# Altium schematic sheet io.SchDoc
size A2; SheetNumber: 2; SheetTotal: 4
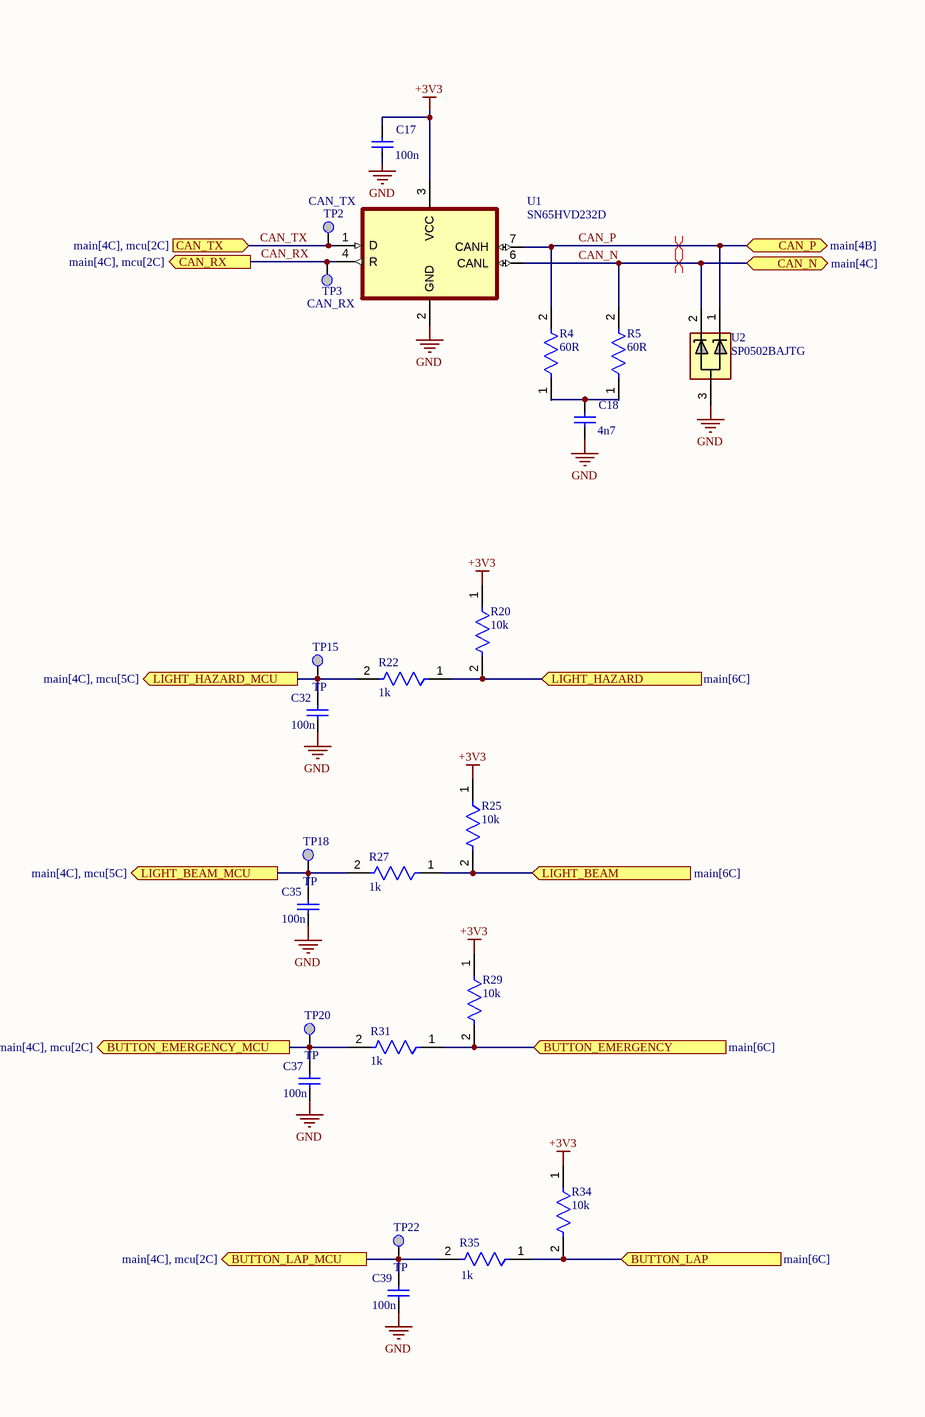
[diagram p0: io.SchDoc, left]
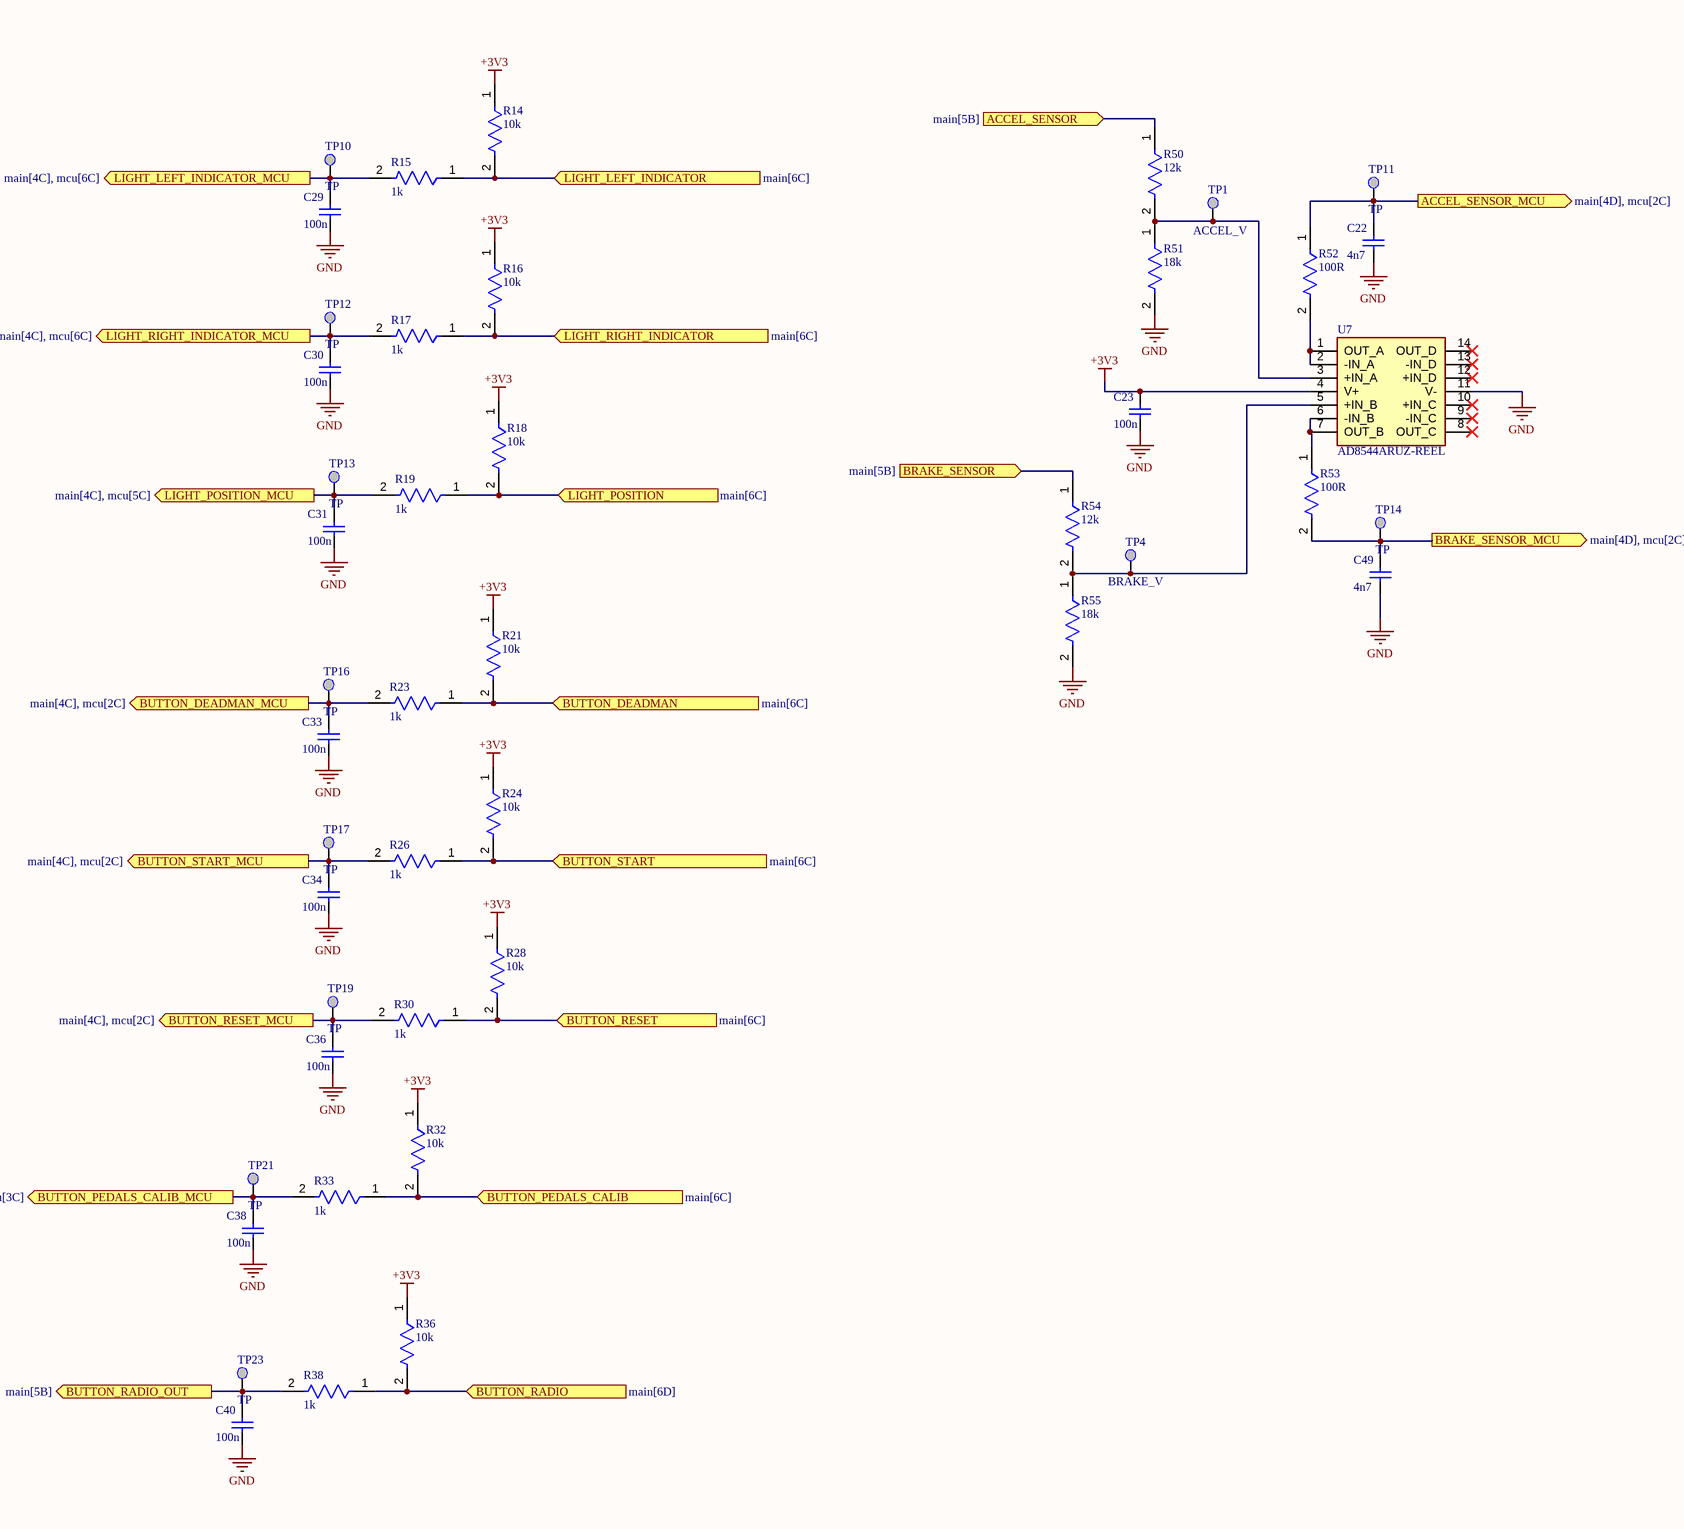
[diagram p1: io.SchDoc, right]

## Parts
C17  100n  [CAPC1206(3216)150_L]
C18  4n7  [CAPC1206(3216)150_L]
C22  4n7  [CAPC1206(3216)150_L]
C23  100n  [CAPC1206(3216)150_L]
C29  100n  [CAPC1206(3216)150_L]
C30  100n  [CAPC1206(3216)150_L]
C31  100n  [CAPC1206(3216)150_L]
C32  100n  [CAPC1206(3216)150_L]
C33  100n  [CAPC1206(3216)150_L]
C34  100n  [CAPC1206(3216)150_L]
C35  100n  [CAPC1206(3216)150_L]
C36  100n  [CAPC1206(3216)150_L]
C37  100n  [CAPC1206(3216)150_L]
C38  100n  [CAPC1206(3216)150_L]
C39  100n  [CAPC1206(3216)150_L]
C40  100n  [CAPC1206(3216)150_L]
C49  4n7  [CAPC1206(3216)150_L]
R4  60R  [FP-RK73H2B-MFG]
R5  60R  [FP-RK73H2B-MFG]
R14  10k  [FP-RK73H2B-MFG]
R15  1k  [FP-RK73H2B-MFG]
R16  10k  [FP-RK73H2B-MFG]
R17  1k  [FP-RK73H2B-MFG]
R18  10k  [FP-RK73H2B-MFG]
R19  1k  [FP-RK73H2B-MFG]
R20  10k  [FP-RK73H2B-MFG]
R21  10k  [FP-RK73H2B-MFG]
R22  1k  [FP-RK73H2B-MFG]
R23  1k  [FP-RK73H2B-MFG]
R24  10k  [FP-RK73H2B-MFG]
R25  10k  [FP-RK73H2B-MFG]
R26  1k  [FP-RK73H2B-MFG]
R27  1k  [FP-RK73H2B-MFG]
R28  10k  [FP-RK73H2B-MFG]
R29  10k  [FP-RK73H2B-MFG]
R30  1k  [FP-RK73H2B-MFG]
R31  1k  [FP-RK73H2B-MFG]
R32  10k  [FP-RK73H2B-MFG]
R33  1k  [FP-RK73H2B-MFG]
R34  10k  [FP-RK73H2B-MFG]
R35  1k  [FP-RK73H2B-MFG]
R36  10k  [FP-RK73H2B-MFG]
R38  1k  [FP-RK73H2B-MFG]
R50  12k  [FP-RK73H2B-MFG]
R51  18k  [FP-RK73H2B-MFG]
R52  100R  [FP-RK73H2B-MFG]
R53  100R  [FP-RK73H2B-MFG]
R54  12k  [FP-RK73H2B-MFG]
R55  18k  [FP-RK73H2B-MFG]
TP1  ACCEL_V  [Test_Point]
TP2  CAN_TX  [Test_Point]
TP3  CAN_RX  [Test_Point]
TP4  BRAKE_V  [Test_Point]
TP10  TP  [Test_Point]
TP11  TP  [Test_Point]
TP12  TP  [Test_Point]
TP13  TP  [Test_Point]
TP14  TP  [Test_Point]
TP15  TP  [Test_Point]
TP16  TP  [Test_Point]
TP17  TP  [Test_Point]
TP18  TP  [Test_Point]
TP19  TP  [Test_Point]
TP20  TP  [Test_Point]
TP21  TP  [Test_Point]
TP22  TP  [Test_Point]
TP23  TP  [Test_Point]
U1  SN65HVD232D  [SN65HVD232D]
U2  SP0502BAJTG  [SOT132P220X110-3N]
U7  AD8544ARUZ-REEL  [AD8544ARUZ-REEL]

## Ports
ACCEL_SENSOR (in, see main[5B]), ACCEL_SENSOR_MCU (out, see main[4D], mcu[2C]), BRAKE_SENSOR (in, see main[5B]), BRAKE_SENSOR_MCU (out, see main[4D], mcu[2C]), BUTTON_DEADMAN (in, see main[6C]), BUTTON_DEADMAN_MCU (out, see main[4C], mcu[2C]), BUTTON_EMERGENCY (in, see main[6C]), BUTTON_EMERGENCY_MCU (out, see main[4C], mcu[2C]), BUTTON_LAP (in, see main[6C]), BUTTON_LAP_MCU (out, see main[4C], mcu[2C]), BUTTON_PEDALS_CALIB (in, see main[6C]), BUTTON_PEDALS_CALIB_MCU (out, see main[4C], mcu[3C]), BUTTON_RADIO (in, see main[6D]), BUTTON_RADIO_OUT (out, see main[5B]), BUTTON_RESET (in, see main[6C]), BUTTON_RESET_MCU (out, see main[4C], mcu[2C]), BUTTON_START (in, see main[6C]), BUTTON_START_MCU (out, see main[4C], mcu[2C]), CAN_N (bidir, see main[4C]), CAN_P (bidir, see main[4B]), CAN_RX (out, see main[4C], mcu[2C]), CAN_TX (in, see main[4C], mcu[2C]), LIGHT_BEAM (in, see main[6C]), LIGHT_BEAM_MCU (out, see main[4C], mcu[5C]), LIGHT_HAZARD (in, see main[6C]), LIGHT_HAZARD_MCU (out, see main[4C], mcu[5C]), LIGHT_LEFT_INDICATOR (in, see main[6C]), LIGHT_LEFT_INDICATOR_MCU (out, see main[4C], mcu[6C]), LIGHT_POSITION (in, see main[6C]), LIGHT_POSITION_MCU (out, see main[4C], mcu[5C]), LIGHT_RIGHT_INDICATOR (in, see main[6C]), LIGHT_RIGHT_INDICATOR_MCU (out, see main[4C], mcu[6C])

## Nets
+3V3: C17.1 C23.1 R14.1 R16.1 R18.1 R20.1 R21.1 R24.1 R25.1 R28.1 R29.1 R32.1 R34.1 R36.1 U1.3(VCC) U7.4(V+)
GND: C17.2 C18.2 C22.2 C23.2 C29.2 C30.2 C31.2 C32.2 C33.2 C34.2 C35.2 C36.2 C37.2 C38.2 C39.2 C40.2 C49.2 R51.2 R55.2 U1.2(GND) U2.3 U7.11(V-)
ACCEL_SENSOR: R50.1 ; port ACCEL_SENSOR
ACCEL_SENSOR_MCU: C22.1 R52.1 TP11.1 ; port ACCEL_SENSOR_MCU
BRAKE_SENSOR: R54.1 ; port BRAKE_SENSOR
BRAKE_SENSOR_MCU: C49.1 R53.2 TP14.1 ; port BRAKE_SENSOR_MCU
BUTTON_DEADMAN: R21.2 R23.1 ; port BUTTON_DEADMAN
BUTTON_DEADMAN_MCU: C33.1 R23.2 TP16.1 ; port BUTTON_DEADMAN_MCU
BUTTON_EMERGENCY: R29.2 R31.1 ; port BUTTON_EMERGENCY
BUTTON_EMERGENCY_MCU: C37.1 R31.2 TP20.1 ; port BUTTON_EMERGENCY_MCU
BUTTON_LAP: R34.2 R35.1 ; port BUTTON_LAP
BUTTON_LAP_MCU: C39.1 R35.2 TP22.1 ; port BUTTON_LAP_MCU
BUTTON_PEDALS_CALIB: R32.2 R33.1 ; port BUTTON_PEDALS_CALIB
BUTTON_PEDALS_CALIB_MCU: C38.1 R33.2 TP21.1 ; port BUTTON_PEDALS_CALIB_MCU
BUTTON_RADIO: R36.2 R38.1 ; port BUTTON_RADIO
BUTTON_RADIO_OUT: C40.1 R38.2 TP23.1 ; port BUTTON_RADIO_OUT
BUTTON_RESET: R28.2 R30.1 ; port BUTTON_RESET
BUTTON_RESET_MCU: C36.1 R30.2 TP19.1 ; port BUTTON_RESET_MCU
BUTTON_START: R24.2 R26.1 ; port BUTTON_START
BUTTON_START_MCU: C34.1 R26.2 TP17.1 ; port BUTTON_START_MCU
CAN_N: R5.2 U1.6(CANL) U2.2 ; port CAN_N
CAN_P: R4.2 U1.7(CANH) U2.1 ; port CAN_P
CAN_RX: TP3.1 U1.4(R) ; port CAN_RX
CAN_TX: TP2.1 U1.1(D) ; port CAN_TX
LIGHT_BEAM: R25.2 R27.1 ; port LIGHT_BEAM
LIGHT_BEAM_MCU: C35.1 R27.2 TP18.1 ; port LIGHT_BEAM_MCU
LIGHT_HAZARD: R20.2 R22.1 ; port LIGHT_HAZARD
LIGHT_HAZARD_MCU: C32.1 R22.2 TP15.1 ; port LIGHT_HAZARD_MCU
LIGHT_LEFT_INDICATOR: R14.2 R15.1 ; port LIGHT_LEFT_INDICATOR
LIGHT_LEFT_INDICATOR_MCU: C29.1 R15.2 TP10.1 ; port LIGHT_LEFT_INDICATOR_MCU
LIGHT_POSITION: R18.2 R19.1 ; port LIGHT_POSITION
LIGHT_POSITION_MCU: C31.1 R19.2 TP13.1 ; port LIGHT_POSITION_MCU
LIGHT_RIGHT_INDICATOR: R16.2 R17.1 ; port LIGHT_RIGHT_INDICATOR
LIGHT_RIGHT_INDICATOR_MCU: C30.1 R17.2 TP12.1 ; port LIGHT_RIGHT_INDICATOR_MCU
NetC18_1: C18.1 R4.1 R5.1
NetR50_2: R50.2 R51.1 TP1.1 U7.3(+IN_A)
NetR52_2: R52.2 U7.1(OUT_A) U7.2(-IN_A)
NetR53_1: R53.1 U7.6(-IN_B) U7.7(OUT_B)
NetR54_2: R54.2 R55.1 TP4.1 U7.5(+IN_B)

Not connected (* = marked no-connect by the designer): U7 8(OUT_C)* 9(-IN_C)* 10(+IN_C)* 12(+IN_D)* 13(-IN_D)* 14(OUT_D)*

## Layout directives
differential pair: CAN_N, CAN_P

## Notes on the sheet
- DWG. NO.
- REV.
- SHT.
- REVISION
- DESCRIPTION
- DATE
- APPROVED
- THIS DOCUMENT AND THE DATA DISCLOSED HEREIN OR HEREWITH IS THE PROPERTY OF ALTIUM LIMITED AND MAY BE FREELY DISTRIBUTED IN WHOLE. NO RIGHTS ARE RESERVED OR EXPRESS OR IMPLIED WARANTEE GIVEN.
- ENG:
- DSN:
- APPROVALS
- PROJECT
- DOCUMENT REVISION:
- DESIGN ITEM:
- CHK:
- BOM:
- REFERENCE DOCUMENTS
- PROJECT REVISION:
- TITLE
- FAB DWG:
- PCB DWG:
- ASSY DWG:
- SCALE:
- SIZE
- C
- CAGE CODE
- FILE NAME
- DWG NO.
- SHEET
- OF
- REV

## Library data of the parts
C17 C18 C22 C23 C29-C40 C49 = CMP-1037-04778-1: CAP 1.8uF 10V ±5% 1206 (3216 Metric) Thickness 1.45mm SMD; Case-EIA: 1206; Tolerance: Â±5%; Case-Metric: 3216; Technology: SMT; Value: 1.8uF; Rated Voltage: 10 V; Max Thickness: 1.45 mm
R4 R5 R14-R36 R38 R50-R55 = CMP-04015-098385-1: 40.2kΩ ±1% 0.25W Chip Resistor 1206 Thick Film AEC-Q200 Qualified; Resistance: 40.2kR; Voltage Rating (DC): 200V; Temperature Coefficient: 100ppm/°C; Power Rating: 250mW; Tolerance: 1%; Package Quantity: 5000; Length: 3.2mm; Termination: SMD/SMT; Lead Free: Contains Lead; Case Code (Imperial): 1206; Case/Package: 1206; Voltage Rating: 200V; Case Code (Metric): 3216; Max Operating Temperature: 155°C; Packaging: Tape and Reel; Width: 1.6mm; Series: RK73H; Min Operating Temperature: -55°C; RoHS Compliant: No; Height: 0.6mm
TP1-TP4 TP10-TP23 = TestPoint
U1 = SN65HVD232D: Texas Instruments - SN65HVD232DR - Can Transceiver, 1MBPS, 1/1, 3.3V, SOIC-8, Full Reel; Manufacturer Lifecycle Status: ACTIVE; Max Supply Voltage: 3.6V; Min Supply Voltage: 3V; Nominal Supply Current: 17mA; Number of Drivers: 1; SnapEDA_Link: https://www.snapeda.com/parts/SN65HVD232D/Texas+Instruments/view-part/?ref=snap; Package: SOIC-8 Texas Instruments; Value: *; MF: Texas Instruments; MP: SN65HVD232D; Check_prices: https://www.snapeda.com/parts/SN65HVD232D/Texas+Instruments/view-part/?ref=eda; Supplier: Arrow Electronics; Supplier Part Number: SN65HVD232DR; Manufacturer: Texas Instruments; Manufacturer Part Number: SN65HVD232DR; RoHS: Compliant; Category: CAN Transceivers; Stock: 10000; Pricing: 2500=1,1159, 5000=1,076, 7500=1,062 (USD); Case/Package: SOIC; Data Rate: 1Mbps; Height: 1.75mm; Lead Free: Lead Free; Length: 4.9mm; Lifecycle Status: Production; Max Operating Temperature: 85°C; Min Operating Temperature: -40°C; Pins: 8; Number of Receive Buffers: 1; Number of Receivers: 1; Number of Transceivers: 1; Number of Transmit Buffers: 1; Packaging: Cut Tape; Radiation Hardening: No; REACH SVHC: No; Schedule B: 8542390000, 8542390000|8542390000|8542390000|8542390000|8542390000; Thickness: 1.58mm; Weight: 72.603129mg; Width: 3.91mm; ComponentLink1URL: https://octopart.com:443/opatz8j6/c1?t=KNMFt9M64p-_id6rZ0-P1CX6CGmvk_NFg0bt7DHXbi_P10EFF0MZE_9gM8ERckOxIywTBgDrXd4Bw1XwEAcVVdK92p9CEfdSNaVajf6_bxnez3EeN1RE1wZBaojbXTwQ_101S7Bb856c3hUAWErS0_zGIM1B6Z6dFQwv_Ps2SUdVVUCjmJkLnMLZKTBWfnIVcgJIheW78JYanUyW_1u-I93chBuiSPXQYIk2xXb9JgOyrE9lHEnesRSQq9luJOd1yknyGQP0N3Is0_dGM9QrGV5UOgjoada9tMnQwKJP8gahr3iTK59XJFH6OfbHTOm3R9BdESCrBMbrE2MVOGPPkVOTrqf0YMovDpmf-konbncFnSES8CNOhHqMwHv2HEwKcPoK44nl&src-supplier=Texas+Instruments; ComponentLink1Description: https://octopart.com:443/opatz8j6/c1?t=KNMFt9M64p-_id6rZ0-P1CX6CGmvk_NFg0bt7DHXbi_P10EFF0MZE_9gM8ERckOxIywTBgDrXd4Bw1XwEAcVVdK92p9CEfdSNaVajf6_bxnez3EeN1RE1wZBaojbXTwQ_101S7Bb856c3hUAWErS0_zGIM1B6Z6dFQwv_Ps2SUdVVUCjmJkLnMLZKTBWfnIVcgJIheW78JYanUyW_1u-I93chBuiSPXQYIk2xXb9JgOyrE9lHEnesRSQq9luJOd1yknyGQP0N3Is0_dGM9QrGV5UOgjoada9tMnQwKJP8gahr3iTK59XJFH6OfbHTOm3R9BdESCrBMbrE2MVOGPPkVOTrqf0YMovDpmf-konbncFnSES8CNOhHqMwHv2HEwKcPoK44nl&src-supplier=Texas+Instruments; ComponentLink2URL: https://sigma.octopart.com:443/49249642/technical_drawing/Texas-Instruments-SN65HVD232DR.pdf?src-supplier=Texas+Instruments; ComponentLink2Description: https://sigma.octopart.com:443/49249642/technical_drawing/Texas-Instruments-SN65HVD232DR.pdf?src-supplier=Texas+Instruments; ComponentLink3URL: https://datasheet.octopart.com:443/SN65HVD232DR-Texas-Instruments-datasheet-81447765.pdf?src-supplier=Upverter; ComponentLink3Description: https://datasheet.octopart.com:443/SN65HVD232DR-Texas-Instruments-datasheet-81447765.pdf?src-supplier=Upverter; ComponentLink4URL: https://datasheet.octopart.com:443/SN65HVD232DR-Texas-Instruments-datasheet-37140773.pdf?src-supplier=Newark; ComponentLink4Description: https://datasheet.octopart.com:443/SN65HVD232DR-Texas-Instruments-datasheet-37140773.pdf?src-supplier=Newark; ComponentLink5URL: https://datasheet.octopart.com:443/SN65HVD232DR-Texas-Instruments-datasheet-14436966.pdf?src-supplier=Newark; ComponentLink5Description: https://datasheet.octopart.com:443/SN65HVD232DR-Texas-Instruments-datasheet-14436966.pdf?src-supplier=Newark; ComponentLink6URL: https://datasheet.octopart.com:443/SN65HVD232DR-Texas-Instruments-datasheet-58296547.pdf?src-supplier=Newark; ComponentLink6Description: https://datasheet.octopart.com:443/SN65HVD232DR-Texas-Instruments-datasheet-58296547.pdf?src-supplier=Newark; ComponentLink7URL: https://datasheet.octopart.com:443/SN65HVD232DR-Texas-Instruments-datasheet-48117850.pdf?src-supplier=Newark; ComponentLink7Description: https://datasheet.octopart.com:443/SN65HVD232DR-Texas-Instruments-datasheet-48117850.pdf?src-supplier=Newark; ComponentLink8URL: https://datasheet.octopart.com:443/SN65HVD232DR-Texas-Instruments-datasheet-10256024.pdf?src-supplier=Arrow+Electronics; ComponentLink8Description: https://datasheet.octopart.com:443/SN65HVD232DR-Texas-Instruments-datasheet-10256024.pdf?src-supplier=Arrow+Electronics; ComponentLink9URL: https://datasheet.octopart.com:443/SN65HVD232DR-Texas-Instruments-datasheet-149765.pdf?src-supplier=Mouser; ComponentLink9Description: https://datasheet.octopart.com:443/SN65HVD232DR-Texas-Instruments-datasheet-149765.pdf?src-supplier=Mouser; ComponentLink10URL: https://datasheet.octopart.com:443/SN65HVD232DR-Texas-Instruments-datasheet-62292544.pdf?src-supplier=Farnell; ComponentLink10Description: https://datasheet.octopart.com:443/SN65HVD232DR-Texas-Instruments-datasheet-62292544.pdf?src-supplier=Farnell; ComponentLink11URL: https://datasheet.octopart.com:443/SN65HVD232DR-Texas-Instruments-datasheet-164416263.pdf?src-supplier=SHENGYU+ELECTRONICS; ComponentLink11Description: https://datasheet.octopart.com:443/SN65HVD232DR-Texas-Instruments-datasheet-164416263.pdf?src-supplier=SHENGYU+ELECTRONICS; ComponentLink12URL: https://datasheet.octopart.com:443/SN65HVD232DR-Texas-Instruments-datasheet-159115712.pdf?src-supplier=LCSC; ComponentLink12Description: https://datasheet.octopart.com:443/SN65HVD232DR-Texas-Instruments-datasheet-159115712.pdf?src-supplier=LCSC; ComponentLink13URL: https://datasheet.octopart.com:443/SN65HVD232DR-Texas-Instruments-datasheet-137316104.pdf?src-supplier=Future+Electronics; ComponentLink13Description: https://datasheet.octopart.com:443/SN65HVD232DR-Texas-Instruments-datasheet-137316104.pdf?src-supplier=Future+Electronics; ComponentLink14URL: https://datasheet.octopart.com:443/SN65HVD232DR-Texas-Instruments-datasheet-8625468.pdf?src-supplier=Verical; ComponentLink14Description: https://datasheet.octopart.com:443/SN65HVD232DR-Texas-Instruments-datasheet-8625468.pdf?src-supplier=Verical; ComponentLink15URL: https://datasheet.octopart.com:443/SN65HVD232DR-Texas-Instruments-datasheet-8378736.pdf?src-supplier=Verical; ComponentLink15Description: https://datasheet.octopart.com:443/SN65HVD232DR-Texas-Instruments-datasheet-8378736.pdf?src-supplier=Verical; ComponentLink16URL: http://sigma.octopart.com:80/conflict_mineral_statement/Texas-Instruments-company-63.pdf?src-supplier=Compliance+Statements; ComponentLink16Description: http://sigma.octopart.com:80/conflict_mineral_statement/Texas-Instruments-company-63.pdf?src-supplier=Compliance+Statements; ComponentLink17URL: http://sigma.octopart.com:80/reach_statement/Texas-Instruments-company-64.pdf?src-supplier=Compliance+Statements; ComponentLink17Description: http://sigma.octopart.com:80/reach_statement/Texas-Instruments-company-64.pdf?src-supplier=Compliance+Statements
U2 = SP0502BAJTG: Integrated Circuit; Manufacturer_Name: LITTELFUSE; Datasheet Link: https://www.littelfuse.com/~/media/electronics/datasheets/tvs_diode_arrays/littelfuse_tvs_diode_array_sp05_datasheet.pdf.pdf; Height: 1.1mm; Manufacturer_Part_Number: SP0502BAJTG; Mouser Part Number: 576-SP0502BAJTG; Mouser Price/Stock: https://www.mouser.co.uk/ProductDetail/Littelfuse/SP0502BAJTG?qs=RnOBYWd%2Fz7cttN1Mwg4HWA%3D%3D; Arrow Part Number: SP0502BAJTG; Arrow Price/Stock: https://www.arrow.com/en/products/sp0502bajtg/littelfuse?region=nac
U7 = AD8544ARUZ-REEL: Single-supply operation: 2.7 V to 5.5 V  Low supply current: 45 A/amplifier  Wide bandwidth: 1 MHz  No phase reversal  Low input currents: 4 pA  Unity gain stable  Rail-to-rail input and output  AEC-Q100 qualified for automotive applications; Manufacturer_Name: Analog Devices; Geometry.Height: 1.2mm; Manufacturer_Part_Number: AD8544ARUZ-REEL; Mouser Part Number: 584-AD8544ARUZ-R; Mouser Price/Stock: https://www.mouser.co.uk/ProductDetail/Analog-Devices/AD8544ARUZ-REEL?qs=%2FtpEQrCGXCzshxYletFRHw%3D%3D; Arrow Part Number: AD8544ARUZ-REEL; Arrow Price/Stock: https://www.arrow.com/en/products/ad8544aruz-reel/analog-devices; Datasheet Link: https://www.analog.com/AD8544/datasheet